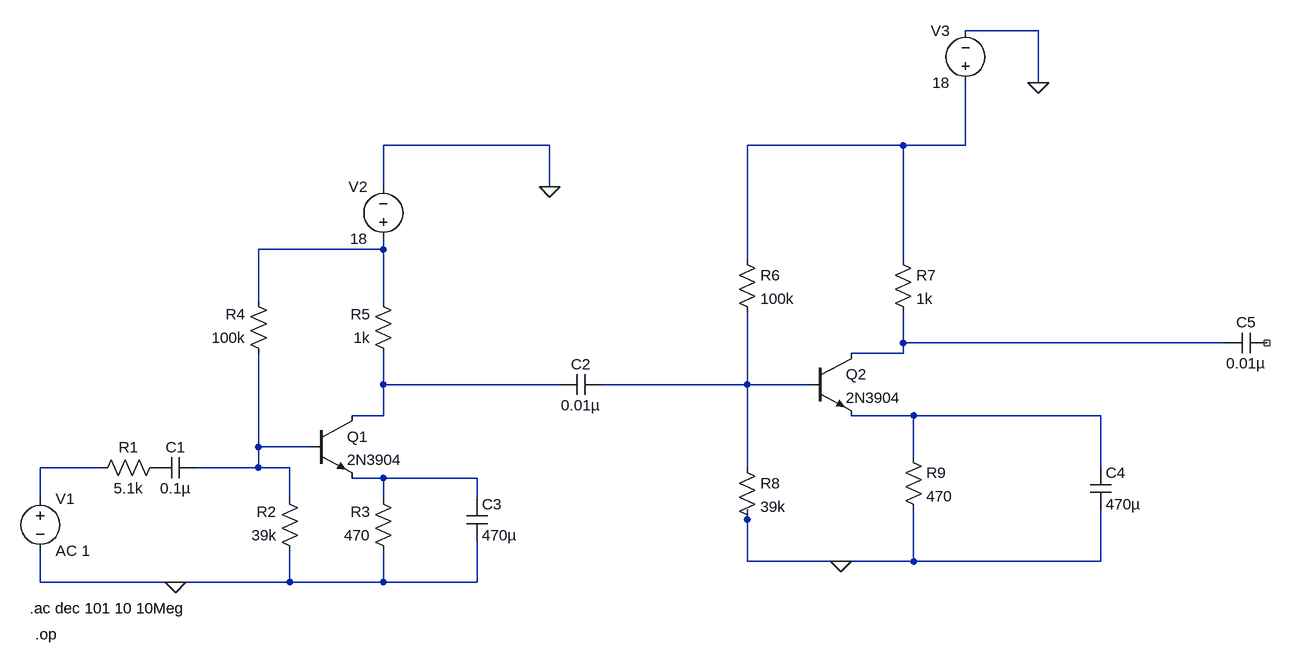
[diagram p0: schematic EXP-3_RCtwoSTAGE.asc]
EXP-3_RCtwoSTAGE.asc, the LTspice schematic file:
Version 4
SHEET 1 1876 680
WIRE 1504 -512 1392 -512
WIRE 1504 -432 1504 -512
WIRE 752 -336 496 -336
WIRE 1296 -336 1056 -336
WIRE 1392 -336 1392 -432
WIRE 1392 -336 1296 -336
WIRE 496 -272 496 -336
WIRE 752 -272 752 -336
WIRE 496 -176 496 -192
WIRE 496 -176 304 -176
WIRE 1056 -160 1056 -336
WIRE 1296 -160 1296 -336
WIRE 304 -96 304 -176
WIRE 496 -96 496 -176
WIRE 1296 -32 1296 -80
WIRE 1792 -32 1296 -32
WIRE 1296 -16 1296 -32
WIRE 1296 -16 1216 -16
WIRE 496 32 496 -16
WIRE 768 32 496 32
WIRE 1056 32 1056 -80
WIRE 1056 32 832 32
WIRE 1152 32 1056 32
WIRE 496 80 496 32
WIRE 496 80 448 80
WIRE 1312 80 1216 80
WIRE 1600 80 1312 80
WIRE 304 128 304 -16
WIRE 384 128 304 128
WIRE 1312 144 1312 80
WIRE 64 160 -32 160
WIRE 304 160 304 128
WIRE 304 160 208 160
WIRE 352 160 304 160
WIRE 1056 160 1056 32
WIRE 1600 160 1600 80
WIRE 496 176 448 176
WIRE 640 176 496 176
WIRE -32 208 -32 160
WIRE 352 208 352 160
WIRE 496 208 496 176
WIRE 640 208 640 176
WIRE 1056 240 1056 224
WIRE 1056 304 1056 240
WIRE 1200 304 1056 304
WIRE 1312 304 1312 224
WIRE 1312 304 1200 304
WIRE 1600 304 1600 224
WIRE 1600 304 1312 304
WIRE -32 336 -32 288
WIRE 176 336 -32 336
WIRE 352 336 352 288
WIRE 352 336 176 336
WIRE 496 336 496 288
WIRE 496 336 352 336
WIRE 640 336 640 272
WIRE 640 336 496 336
FLAG 752 -272 0
FLAG 1200 304 0
FLAG 1504 -432 0
FLAG 176 336 0
SYMBOL voltage -32 192 R0
WINDOW 123 0 0 Left 0
WINDOW 39 0 0 Left 0
SYMATTR InstName V1
SYMATTR Value AC 1
SYMBOL res 160 144 R90
WINDOW 0 0 56 VBottom 2
WINDOW 3 32 56 VTop 2
SYMATTR InstName R1
SYMATTR Value 5.1k
SYMBOL res 368 304 R180
WINDOW 0 36 76 Left 2
WINDOW 3 36 40 Left 2
SYMATTR InstName R2
SYMATTR Value 39k
SYMBOL res 512 304 R180
WINDOW 0 36 76 Left 2
WINDOW 3 36 40 Left 2
SYMATTR InstName R3
SYMATTR Value 470
SYMBOL res 320 0 R180
WINDOW 0 36 76 Left 2
WINDOW 3 36 40 Left 2
SYMATTR InstName R4
SYMATTR Value 100k
SYMBOL res 512 0 R180
WINDOW 0 36 76 Left 2
WINDOW 3 36 40 Left 2
SYMATTR InstName R5
SYMATTR Value 1k
SYMBOL cap 208 144 R90
WINDOW 0 0 32 VBottom 2
WINDOW 3 32 32 VTop 2
SYMATTR InstName C1
SYMATTR Value 0.1µ
SYMBOL npn 384 80 R0
SYMATTR InstName Q1
SYMATTR Value 2N3904
SYMBOL voltage 496 -176 R180
WINDOW 0 24 96 Left 2
WINDOW 3 24 16 Left 2
WINDOW 123 0 0 Left 0
WINDOW 39 0 0 Left 0
SYMATTR InstName V2
SYMATTR Value 18
SYMBOL cap 832 16 R90
WINDOW 0 0 32 VBottom 2
WINDOW 3 32 32 VTop 2
SYMATTR InstName C2
SYMATTR Value 0.01µ
SYMBOL cap 624 208 R0
SYMATTR InstName C3
SYMATTR Value 470µ
SYMBOL res 1040 -176 R0
SYMATTR InstName R6
SYMATTR Value 100k
SYMBOL res 1280 -176 R0
SYMATTR InstName R7
SYMATTR Value 1k
SYMBOL res 1040 144 R0
SYMATTR InstName R8
SYMATTR Value 39k
SYMBOL res 1296 128 R0
SYMATTR InstName R9
SYMATTR Value 470
SYMBOL cap 1584 160 R0
SYMATTR InstName C4
SYMATTR Value 470µ
SYMBOL cap 1856 -48 R90
WINDOW 0 0 32 VBottom 2
WINDOW 3 32 32 VTop 2
SYMATTR InstName C5
SYMATTR Value 0.01µ
SYMBOL voltage 1392 -416 R180
WINDOW 0 24 96 Left 2
WINDOW 3 24 16 Left 2
WINDOW 123 0 0 Left 0
WINDOW 39 0 0 Left 0
SYMATTR InstName V3
SYMATTR Value 18
SYMBOL npn 1152 -16 R0
SYMATTR InstName Q2
SYMATTR Value 2N3904
TEXT -48 376 Left 2 !.ac dec 101 10 10Meg
TEXT -40 416 Left 2 !.op

The netlist it stands for:
* EXP-3_RCtwoSTAGE.asc
V1 N008 0 AC 1
R1 P001 N008 5.1k
R2 0 N007 39k
R3 0 N009 470
R4 N007 N002 100k
R5 N004 N002 1k
C1 N007 P001 0.1µ
Q1 N004 N007 N009 0 2N3904
V2 N002 0 18
C2 N005 N004 0.01µ
C3 N009 0 470µ
R6 N001 N005 100k
R7 N001 N003 1k
R8 N005 0 39k
R9 N006 0 470
C4 N006 0 470µ
C5 NC_01 N003 0.01µ
V3 N001 0 18
Q2 N003 N005 N006 0 2N3904
.model NPN NPN
.model PNP PNP
.lib standard.bjt
.ac dec 101 10 10Meg
.op
.backanno
.end